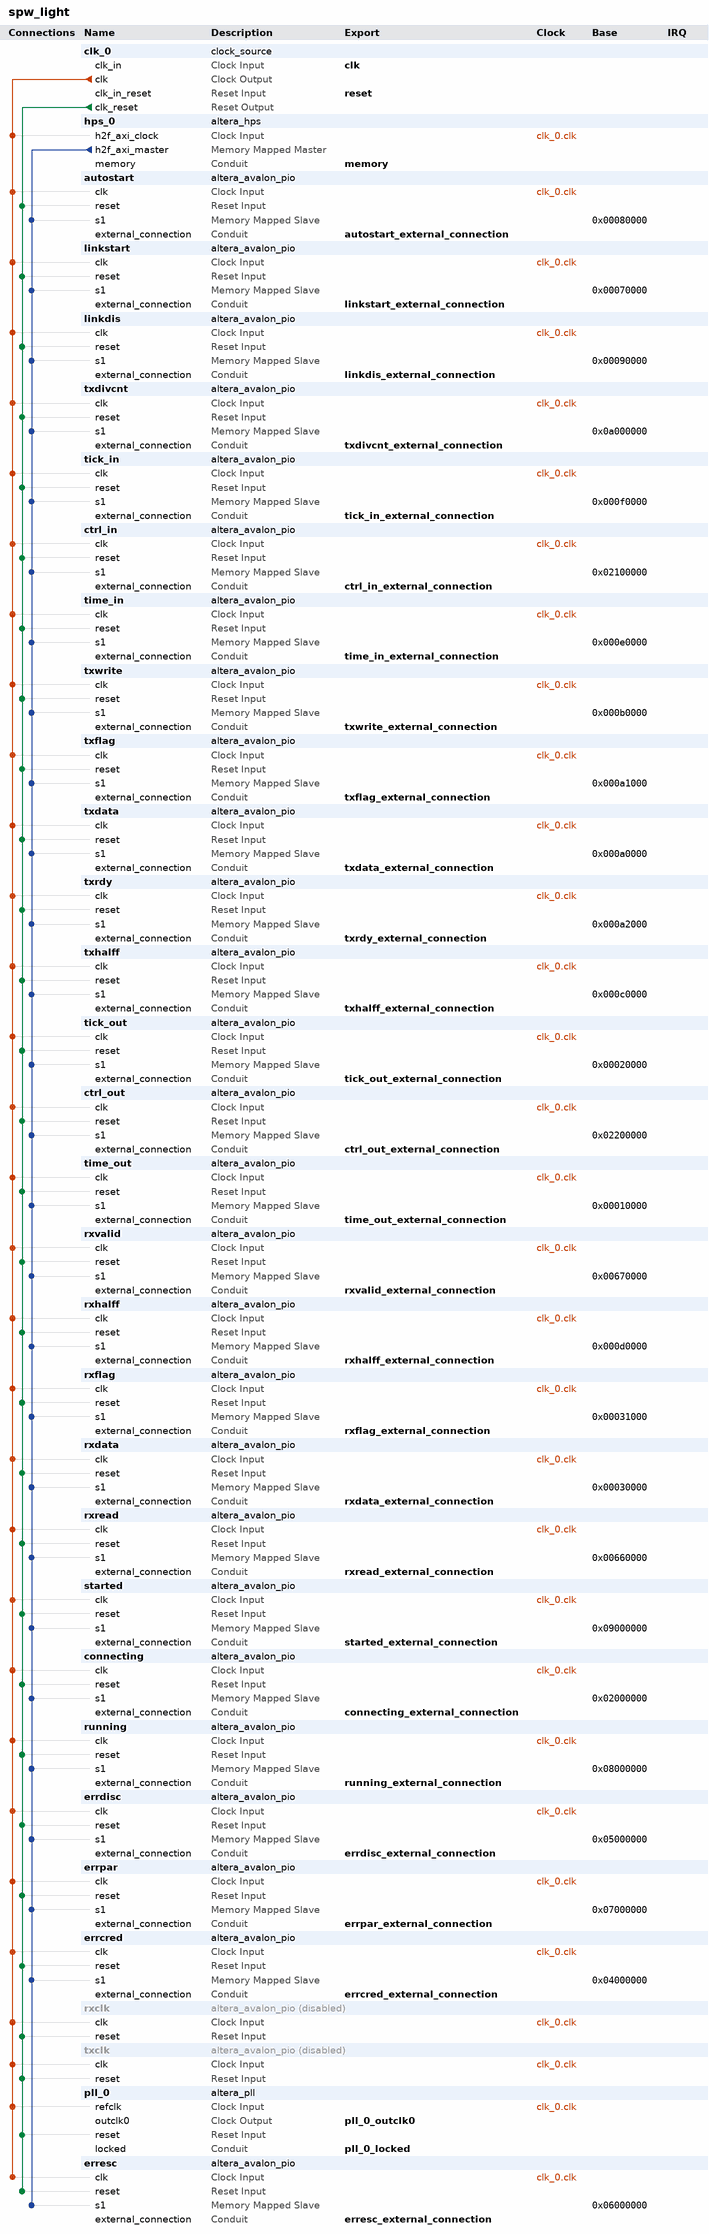
[diagram p0: system contents]
# Platform Designer (Qsys) system spw_light, Cyclone V 5CSEMA4U23C6
# Parameters at their usual value, and those the tool derives, are not listed.
package require -exact qsys 17.1
create_system spw_light
set_project_property DEVICE_FAMILY {Cyclone V}
set_project_property DEVICE 5CSEMA4U23C6

add_instance clk_0 clock_source 17.1
set_instance_parameter_value clk_0 clockFrequency 50000000

add_instance hps_0 altera_hps 17.1
set_instance_parameter_value hps_0 EMAC1_Mode N/A
set_instance_parameter_value hps_0 EMAC1_PinMuxing Unused
set_instance_parameter_value hps_0 F2SCLK_COLDRST_Enable false
set_instance_parameter_value hps_0 F2SCLK_DBGRST_Enable false
set_instance_parameter_value hps_0 F2SCLK_WARMRST_Enable false
set_instance_parameter_value hps_0 F2SINTERRUPT_Enable false
set_instance_parameter_value hps_0 F2S_Width 0
set_instance_parameter_value hps_0 FPGA_PERIPHERAL_OUTPUT_CLOCK_FREQ_EMAC0_GTX_CLK 125
set_instance_parameter_value hps_0 FPGA_PERIPHERAL_OUTPUT_CLOCK_FREQ_EMAC0_MD_CLK 2.5
set_instance_parameter_value hps_0 FPGA_PERIPHERAL_OUTPUT_CLOCK_FREQ_EMAC1_GTX_CLK 125
set_instance_parameter_value hps_0 FPGA_PERIPHERAL_OUTPUT_CLOCK_FREQ_EMAC1_MD_CLK 2.5
set_instance_parameter_value hps_0 HPS_PROTOCOL DDR3
set_instance_parameter_value hps_0 I2C0_Mode N/A
set_instance_parameter_value hps_0 I2C0_PinMuxing Unused
set_instance_parameter_value hps_0 I2C1_Mode N/A
set_instance_parameter_value hps_0 I2C1_PinMuxing Unused
set_instance_parameter_value hps_0 LWH2F_Enable false
set_instance_parameter_value hps_0 MEM_BANKADDR_WIDTH 3
set_instance_parameter_value hps_0 MEM_CLK_FREQ 300.0
set_instance_parameter_value hps_0 MEM_CLK_FREQ_MAX 400.0
set_instance_parameter_value hps_0 MEM_COL_ADDR_WIDTH 8
set_instance_parameter_value hps_0 MEM_DQ_WIDTH 8
set_instance_parameter_value hps_0 MEM_DRV_STR RZQ/6
set_instance_parameter_value hps_0 MEM_ROW_ADDR_WIDTH 12
set_instance_parameter_value hps_0 MEM_RTT_NOM {ODT Disabled}
set_instance_parameter_value hps_0 MEM_RTT_WR {Dynamic ODT off}
set_instance_parameter_value hps_0 MEM_TCL 7
set_instance_parameter_value hps_0 MEM_TFAW_NS 37.5
set_instance_parameter_value hps_0 MEM_TINIT_US 499
set_instance_parameter_value hps_0 MEM_TMRD_CK 3
set_instance_parameter_value hps_0 MEM_TRAS_NS 40.0
set_instance_parameter_value hps_0 MEM_TRCD_NS 15.0
set_instance_parameter_value hps_0 MEM_TREFI_US 7.0
set_instance_parameter_value hps_0 MEM_TRFC_NS 75.0
set_instance_parameter_value hps_0 MEM_TRP_NS 15.0
set_instance_parameter_value hps_0 MEM_TWTR 2
set_instance_parameter_value hps_0 MEM_VENDOR JEDEC
set_instance_parameter_value hps_0 MEM_WTCL 6
set_instance_parameter_value hps_0 QSPI_Mode N/A
set_instance_parameter_value hps_0 QSPI_PinMuxing Unused
set_instance_parameter_value hps_0 REF_CLK_FREQ 125.0
set_instance_parameter_value hps_0 S2FCLK_USER2CLK 5
set_instance_parameter_value hps_0 S2F_Width 1
set_instance_parameter_value hps_0 SDIO_Mode N/A
set_instance_parameter_value hps_0 SDIO_PinMuxing Unused
set_instance_parameter_value hps_0 SPIM1_Mode N/A
set_instance_parameter_value hps_0 SPIM1_PinMuxing Unused
set_instance_parameter_value hps_0 STM_Enable false
set_instance_parameter_value hps_0 TIMING_BOARD_AC_SKEW 0.02
set_instance_parameter_value hps_0 TIMING_BOARD_AC_TO_CK_SKEW 0.0
set_instance_parameter_value hps_0 TIMING_BOARD_DQ_TO_DQS_SKEW 0.0
set_instance_parameter_value hps_0 TIMING_BOARD_MAX_CK_DELAY 0.6
set_instance_parameter_value hps_0 TIMING_BOARD_MAX_DQS_DELAY 0.6
set_instance_parameter_value hps_0 TIMING_BOARD_SKEW_BETWEEN_DQS 0.02
set_instance_parameter_value hps_0 TIMING_BOARD_SKEW_CKDQS_DIMM_MAX 0.01
set_instance_parameter_value hps_0 TIMING_BOARD_SKEW_CKDQS_DIMM_MIN -0.01
set_instance_parameter_value hps_0 TIMING_BOARD_SKEW_WITHIN_DQS 0.02
set_instance_parameter_value hps_0 TIMING_TDH 125
set_instance_parameter_value hps_0 TIMING_TDQSCK 400
set_instance_parameter_value hps_0 TIMING_TDQSQ 120
set_instance_parameter_value hps_0 TIMING_TDS 50
set_instance_parameter_value hps_0 TIMING_TIH 250
set_instance_parameter_value hps_0 TIMING_TIS 175
set_instance_parameter_value hps_0 TIMING_TQSH 0.38
set_instance_parameter_value hps_0 UART0_Mode N/A
set_instance_parameter_value hps_0 UART0_PinMuxing Unused
set_instance_parameter_value hps_0 USB1_Mode N/A
set_instance_parameter_value hps_0 USB1_PinMuxing Unused
set_instance_parameter_value hps_0 desired_cfg_clk_mhz 100.0
set_instance_parameter_value hps_0 desired_qspi_clk_mhz 400.0
set_instance_parameter_value hps_0 eosc1_clk_mhz 50.0
set_instance_parameter_value hps_0 eosc2_clk_mhz 50.0

add_instance autostart altera_avalon_pio 17.1
set_instance_parameter_value autostart direction Output
set_instance_parameter_value autostart width 1

add_instance linkstart altera_avalon_pio 17.1
set_instance_parameter_value linkstart direction Output
set_instance_parameter_value linkstart width 1

add_instance linkdis altera_avalon_pio 17.1
set_instance_parameter_value linkdis direction Output
set_instance_parameter_value linkdis width 1

add_instance txdivcnt altera_avalon_pio 17.1
set_instance_parameter_value txdivcnt direction Output
set_instance_parameter_value txdivcnt width 8

add_instance tick_in altera_avalon_pio 17.1
set_instance_parameter_value tick_in direction Output
set_instance_parameter_value tick_in width 1

add_instance ctrl_in altera_avalon_pio 17.1
set_instance_parameter_value ctrl_in direction Output
set_instance_parameter_value ctrl_in width 2

add_instance time_in altera_avalon_pio 17.1
set_instance_parameter_value time_in direction Output
set_instance_parameter_value time_in width 6

add_instance txwrite altera_avalon_pio 17.1
set_instance_parameter_value txwrite direction Output
set_instance_parameter_value txwrite width 1

add_instance txflag altera_avalon_pio 17.1
set_instance_parameter_value txflag direction Output
set_instance_parameter_value txflag width 1

add_instance txdata altera_avalon_pio 17.1
set_instance_parameter_value txdata direction Output
set_instance_parameter_value txdata width 8

add_instance txrdy altera_avalon_pio 17.1
set_instance_parameter_value txrdy direction Input
set_instance_parameter_value txrdy width 1

add_instance txhalff altera_avalon_pio 17.1
set_instance_parameter_value txhalff direction Input
set_instance_parameter_value txhalff width 1

add_instance tick_out altera_avalon_pio 17.1
set_instance_parameter_value tick_out direction Input
set_instance_parameter_value tick_out width 1

add_instance ctrl_out altera_avalon_pio 17.1
set_instance_parameter_value ctrl_out direction Input
set_instance_parameter_value ctrl_out width 2

add_instance time_out altera_avalon_pio 17.1
set_instance_parameter_value time_out direction Input
set_instance_parameter_value time_out width 6

add_instance rxvalid altera_avalon_pio 17.1
set_instance_parameter_value rxvalid direction Input
set_instance_parameter_value rxvalid width 1

add_instance rxhalff altera_avalon_pio 17.1
set_instance_parameter_value rxhalff direction Input
set_instance_parameter_value rxhalff width 1

add_instance rxflag altera_avalon_pio 17.1
set_instance_parameter_value rxflag direction Input
set_instance_parameter_value rxflag width 1

add_instance rxdata altera_avalon_pio 17.1
set_instance_parameter_value rxdata direction Input
set_instance_parameter_value rxdata width 8

add_instance rxread altera_avalon_pio 17.1
set_instance_parameter_value rxread direction Output
set_instance_parameter_value rxread width 1

add_instance started altera_avalon_pio 17.1
set_instance_parameter_value started direction Input
set_instance_parameter_value started width 1

add_instance connecting altera_avalon_pio 17.1
set_instance_parameter_value connecting direction Input
set_instance_parameter_value connecting width 1

add_instance running altera_avalon_pio 17.1
set_instance_parameter_value running direction Input
set_instance_parameter_value running width 1

add_instance errdisc altera_avalon_pio 17.1
set_instance_parameter_value errdisc direction Input
set_instance_parameter_value errdisc width 1

add_instance errpar altera_avalon_pio 17.1
set_instance_parameter_value errpar direction Input
set_instance_parameter_value errpar width 1

add_instance errcred altera_avalon_pio 17.1
set_instance_parameter_value errcred direction Input
set_instance_parameter_value errcred width 1

add_instance rxclk altera_avalon_pio 17.1
set_instance_property rxclk ENABLED false
set_instance_parameter_value rxclk direction Output
set_instance_parameter_value rxclk width 1

add_instance txclk altera_avalon_pio 17.1
set_instance_property txclk ENABLED false
set_instance_parameter_value txclk direction Output
set_instance_parameter_value txclk width 1

add_instance pll_0 altera_pll 17.1
set_instance_parameter_value pll_0 gui_device_speed_grade 1
set_instance_parameter_value pll_0 gui_number_of_clocks 1
set_instance_parameter_value pll_0 gui_operation_mode direct
set_instance_parameter_value pll_0 gui_output_clock_frequency0 200.0
set_instance_parameter_value pll_0 gui_pll_mode {Integer-N PLL}
set_instance_parameter_value pll_0 gui_reference_clock_frequency 50.0
set_instance_parameter_value pll_0 gui_use_locked true

add_instance erresc altera_avalon_pio 17.1
set_instance_parameter_value erresc direction Input
set_instance_parameter_value erresc width 1

# connections
add_connection clk_0.clk autostart.clk clock
add_connection clk_0.clk connecting.clk clock
add_connection clk_0.clk ctrl_in.clk clock
add_connection clk_0.clk ctrl_out.clk clock
add_connection clk_0.clk errcred.clk clock
add_connection clk_0.clk errdisc.clk clock
add_connection clk_0.clk erresc.clk clock
add_connection clk_0.clk errpar.clk clock
add_connection clk_0.clk hps_0.h2f_axi_clock clock
add_connection clk_0.clk linkdis.clk clock
add_connection clk_0.clk linkstart.clk clock
add_connection clk_0.clk pll_0.refclk clock
add_connection clk_0.clk running.clk clock
add_connection clk_0.clk rxclk.clk clock
add_connection clk_0.clk rxdata.clk clock
add_connection clk_0.clk rxflag.clk clock
add_connection clk_0.clk rxhalff.clk clock
add_connection clk_0.clk rxread.clk clock
add_connection clk_0.clk rxvalid.clk clock
add_connection clk_0.clk started.clk clock
add_connection clk_0.clk tick_in.clk clock
add_connection clk_0.clk tick_out.clk clock
add_connection clk_0.clk time_in.clk clock
add_connection clk_0.clk time_out.clk clock
add_connection clk_0.clk txclk.clk clock
add_connection clk_0.clk txdata.clk clock
add_connection clk_0.clk txdivcnt.clk clock
add_connection clk_0.clk txflag.clk clock
add_connection clk_0.clk txhalff.clk clock
add_connection clk_0.clk txrdy.clk clock
add_connection clk_0.clk txwrite.clk clock
add_connection clk_0.clk_reset autostart.reset reset
add_connection clk_0.clk_reset connecting.reset reset
add_connection clk_0.clk_reset ctrl_in.reset reset
add_connection clk_0.clk_reset ctrl_out.reset reset
add_connection clk_0.clk_reset errcred.reset reset
add_connection clk_0.clk_reset errdisc.reset reset
add_connection clk_0.clk_reset erresc.reset reset
add_connection clk_0.clk_reset errpar.reset reset
add_connection clk_0.clk_reset linkdis.reset reset
add_connection clk_0.clk_reset linkstart.reset reset
add_connection clk_0.clk_reset pll_0.reset reset
add_connection clk_0.clk_reset running.reset reset
add_connection clk_0.clk_reset rxclk.reset reset
add_connection clk_0.clk_reset rxdata.reset reset
add_connection clk_0.clk_reset rxflag.reset reset
add_connection clk_0.clk_reset rxhalff.reset reset
add_connection clk_0.clk_reset rxread.reset reset
add_connection clk_0.clk_reset rxvalid.reset reset
add_connection clk_0.clk_reset started.reset reset
add_connection clk_0.clk_reset tick_in.reset reset
add_connection clk_0.clk_reset tick_out.reset reset
add_connection clk_0.clk_reset time_in.reset reset
add_connection clk_0.clk_reset time_out.reset reset
add_connection clk_0.clk_reset txclk.reset reset
add_connection clk_0.clk_reset txdata.reset reset
add_connection clk_0.clk_reset txdivcnt.reset reset
add_connection clk_0.clk_reset txflag.reset reset
add_connection clk_0.clk_reset txhalff.reset reset
add_connection clk_0.clk_reset txrdy.reset reset
add_connection clk_0.clk_reset txwrite.reset reset
add_connection hps_0.h2f_axi_master autostart.s1 avalon
set_connection_parameter_value hps_0.h2f_axi_master/autostart.s1 baseAddress 0x00080000
add_connection hps_0.h2f_axi_master connecting.s1 avalon
set_connection_parameter_value hps_0.h2f_axi_master/connecting.s1 baseAddress 0x02000000
add_connection hps_0.h2f_axi_master ctrl_in.s1 avalon
set_connection_parameter_value hps_0.h2f_axi_master/ctrl_in.s1 baseAddress 0x02100000
add_connection hps_0.h2f_axi_master ctrl_out.s1 avalon
set_connection_parameter_value hps_0.h2f_axi_master/ctrl_out.s1 baseAddress 0x02200000
add_connection hps_0.h2f_axi_master errcred.s1 avalon
set_connection_parameter_value hps_0.h2f_axi_master/errcred.s1 baseAddress 0x04000000
add_connection hps_0.h2f_axi_master errdisc.s1 avalon
set_connection_parameter_value hps_0.h2f_axi_master/errdisc.s1 baseAddress 0x05000000
add_connection hps_0.h2f_axi_master erresc.s1 avalon
set_connection_parameter_value hps_0.h2f_axi_master/erresc.s1 baseAddress 0x06000000
add_connection hps_0.h2f_axi_master errpar.s1 avalon
set_connection_parameter_value hps_0.h2f_axi_master/errpar.s1 baseAddress 0x07000000
add_connection hps_0.h2f_axi_master linkdis.s1 avalon
set_connection_parameter_value hps_0.h2f_axi_master/linkdis.s1 baseAddress 0x00090000
add_connection hps_0.h2f_axi_master linkstart.s1 avalon
set_connection_parameter_value hps_0.h2f_axi_master/linkstart.s1 baseAddress 0x00070000
add_connection hps_0.h2f_axi_master running.s1 avalon
set_connection_parameter_value hps_0.h2f_axi_master/running.s1 baseAddress 0x08000000
add_connection hps_0.h2f_axi_master rxdata.s1 avalon
set_connection_parameter_value hps_0.h2f_axi_master/rxdata.s1 baseAddress 0x00030000
add_connection hps_0.h2f_axi_master rxflag.s1 avalon
set_connection_parameter_value hps_0.h2f_axi_master/rxflag.s1 baseAddress 0x00031000
add_connection hps_0.h2f_axi_master rxhalff.s1 avalon
set_connection_parameter_value hps_0.h2f_axi_master/rxhalff.s1 baseAddress 0x000d0000
add_connection hps_0.h2f_axi_master rxread.s1 avalon
set_connection_parameter_value hps_0.h2f_axi_master/rxread.s1 baseAddress 0x00660000
add_connection hps_0.h2f_axi_master rxvalid.s1 avalon
set_connection_parameter_value hps_0.h2f_axi_master/rxvalid.s1 baseAddress 0x00670000
add_connection hps_0.h2f_axi_master started.s1 avalon
set_connection_parameter_value hps_0.h2f_axi_master/started.s1 baseAddress 0x09000000
add_connection hps_0.h2f_axi_master tick_in.s1 avalon
set_connection_parameter_value hps_0.h2f_axi_master/tick_in.s1 baseAddress 0x000f0000
add_connection hps_0.h2f_axi_master tick_out.s1 avalon
set_connection_parameter_value hps_0.h2f_axi_master/tick_out.s1 baseAddress 0x00020000
add_connection hps_0.h2f_axi_master time_in.s1 avalon
set_connection_parameter_value hps_0.h2f_axi_master/time_in.s1 baseAddress 0x000e0000
add_connection hps_0.h2f_axi_master time_out.s1 avalon
set_connection_parameter_value hps_0.h2f_axi_master/time_out.s1 baseAddress 0x00010000
add_connection hps_0.h2f_axi_master txdata.s1 avalon
set_connection_parameter_value hps_0.h2f_axi_master/txdata.s1 baseAddress 0x000a0000
add_connection hps_0.h2f_axi_master txdivcnt.s1 avalon
set_connection_parameter_value hps_0.h2f_axi_master/txdivcnt.s1 baseAddress 0x0a000000
add_connection hps_0.h2f_axi_master txflag.s1 avalon
set_connection_parameter_value hps_0.h2f_axi_master/txflag.s1 baseAddress 0x000a1000
add_connection hps_0.h2f_axi_master txhalff.s1 avalon
set_connection_parameter_value hps_0.h2f_axi_master/txhalff.s1 baseAddress 0x000c0000
add_connection hps_0.h2f_axi_master txrdy.s1 avalon
set_connection_parameter_value hps_0.h2f_axi_master/txrdy.s1 baseAddress 0x000a2000
add_connection hps_0.h2f_axi_master txwrite.s1 avalon
set_connection_parameter_value hps_0.h2f_axi_master/txwrite.s1 baseAddress 0x000b0000

# exported interfaces
add_interface autostart_external_connection conduit end
set_interface_property autostart_external_connection EXPORT_OF autostart.external_connection
add_interface clk clock sink
set_interface_property clk EXPORT_OF clk_0.clk_in
add_interface connecting_external_connection conduit end
set_interface_property connecting_external_connection EXPORT_OF connecting.external_connection
add_interface ctrl_in_external_connection conduit end
set_interface_property ctrl_in_external_connection EXPORT_OF ctrl_in.external_connection
add_interface ctrl_out_external_connection conduit end
set_interface_property ctrl_out_external_connection EXPORT_OF ctrl_out.external_connection
add_interface errcred_external_connection conduit end
set_interface_property errcred_external_connection EXPORT_OF errcred.external_connection
add_interface errdisc_external_connection conduit end
set_interface_property errdisc_external_connection EXPORT_OF errdisc.external_connection
add_interface erresc_external_connection conduit end
set_interface_property erresc_external_connection EXPORT_OF erresc.external_connection
add_interface errpar_external_connection conduit end
set_interface_property errpar_external_connection EXPORT_OF errpar.external_connection
add_interface linkdis_external_connection conduit end
set_interface_property linkdis_external_connection EXPORT_OF linkdis.external_connection
add_interface linkstart_external_connection conduit end
set_interface_property linkstart_external_connection EXPORT_OF linkstart.external_connection
add_interface memory conduit end
set_interface_property memory EXPORT_OF hps_0.memory
add_interface pll_0_locked conduit end
set_interface_property pll_0_locked EXPORT_OF pll_0.locked
add_interface pll_0_outclk0 clock source
set_interface_property pll_0_outclk0 EXPORT_OF pll_0.outclk0
add_interface reset reset sink
set_interface_property reset EXPORT_OF clk_0.clk_in_reset
add_interface running_external_connection conduit end
set_interface_property running_external_connection EXPORT_OF running.external_connection
add_interface rxdata_external_connection conduit end
set_interface_property rxdata_external_connection EXPORT_OF rxdata.external_connection
add_interface rxflag_external_connection conduit end
set_interface_property rxflag_external_connection EXPORT_OF rxflag.external_connection
add_interface rxhalff_external_connection conduit end
set_interface_property rxhalff_external_connection EXPORT_OF rxhalff.external_connection
add_interface rxread_external_connection conduit end
set_interface_property rxread_external_connection EXPORT_OF rxread.external_connection
add_interface rxvalid_external_connection conduit end
set_interface_property rxvalid_external_connection EXPORT_OF rxvalid.external_connection
add_interface started_external_connection conduit end
set_interface_property started_external_connection EXPORT_OF started.external_connection
add_interface tick_in_external_connection conduit end
set_interface_property tick_in_external_connection EXPORT_OF tick_in.external_connection
add_interface tick_out_external_connection conduit end
set_interface_property tick_out_external_connection EXPORT_OF tick_out.external_connection
add_interface time_in_external_connection conduit end
set_interface_property time_in_external_connection EXPORT_OF time_in.external_connection
add_interface time_out_external_connection conduit end
set_interface_property time_out_external_connection EXPORT_OF time_out.external_connection
add_interface txdata_external_connection conduit end
set_interface_property txdata_external_connection EXPORT_OF txdata.external_connection
add_interface txdivcnt_external_connection conduit end
set_interface_property txdivcnt_external_connection EXPORT_OF txdivcnt.external_connection
add_interface txflag_external_connection conduit end
set_interface_property txflag_external_connection EXPORT_OF txflag.external_connection
add_interface txhalff_external_connection conduit end
set_interface_property txhalff_external_connection EXPORT_OF txhalff.external_connection
add_interface txrdy_external_connection conduit end
set_interface_property txrdy_external_connection EXPORT_OF txrdy.external_connection
add_interface txwrite_external_connection conduit end
set_interface_property txwrite_external_connection EXPORT_OF txwrite.external_connection

set_interconnect_requirement {$system} qsys_mm.clockCrossingAdapter HANDSHAKE
set_interconnect_requirement {$system} qsys_mm.enableEccProtection FALSE
set_interconnect_requirement {$system} qsys_mm.insertDefaultSlave FALSE
set_interconnect_requirement {$system} qsys_mm.maxAdditionalLatency 1

save_system spw_light.qsys
